# EAGLE design receiver_rev_a (EAGLE 7.3.0)
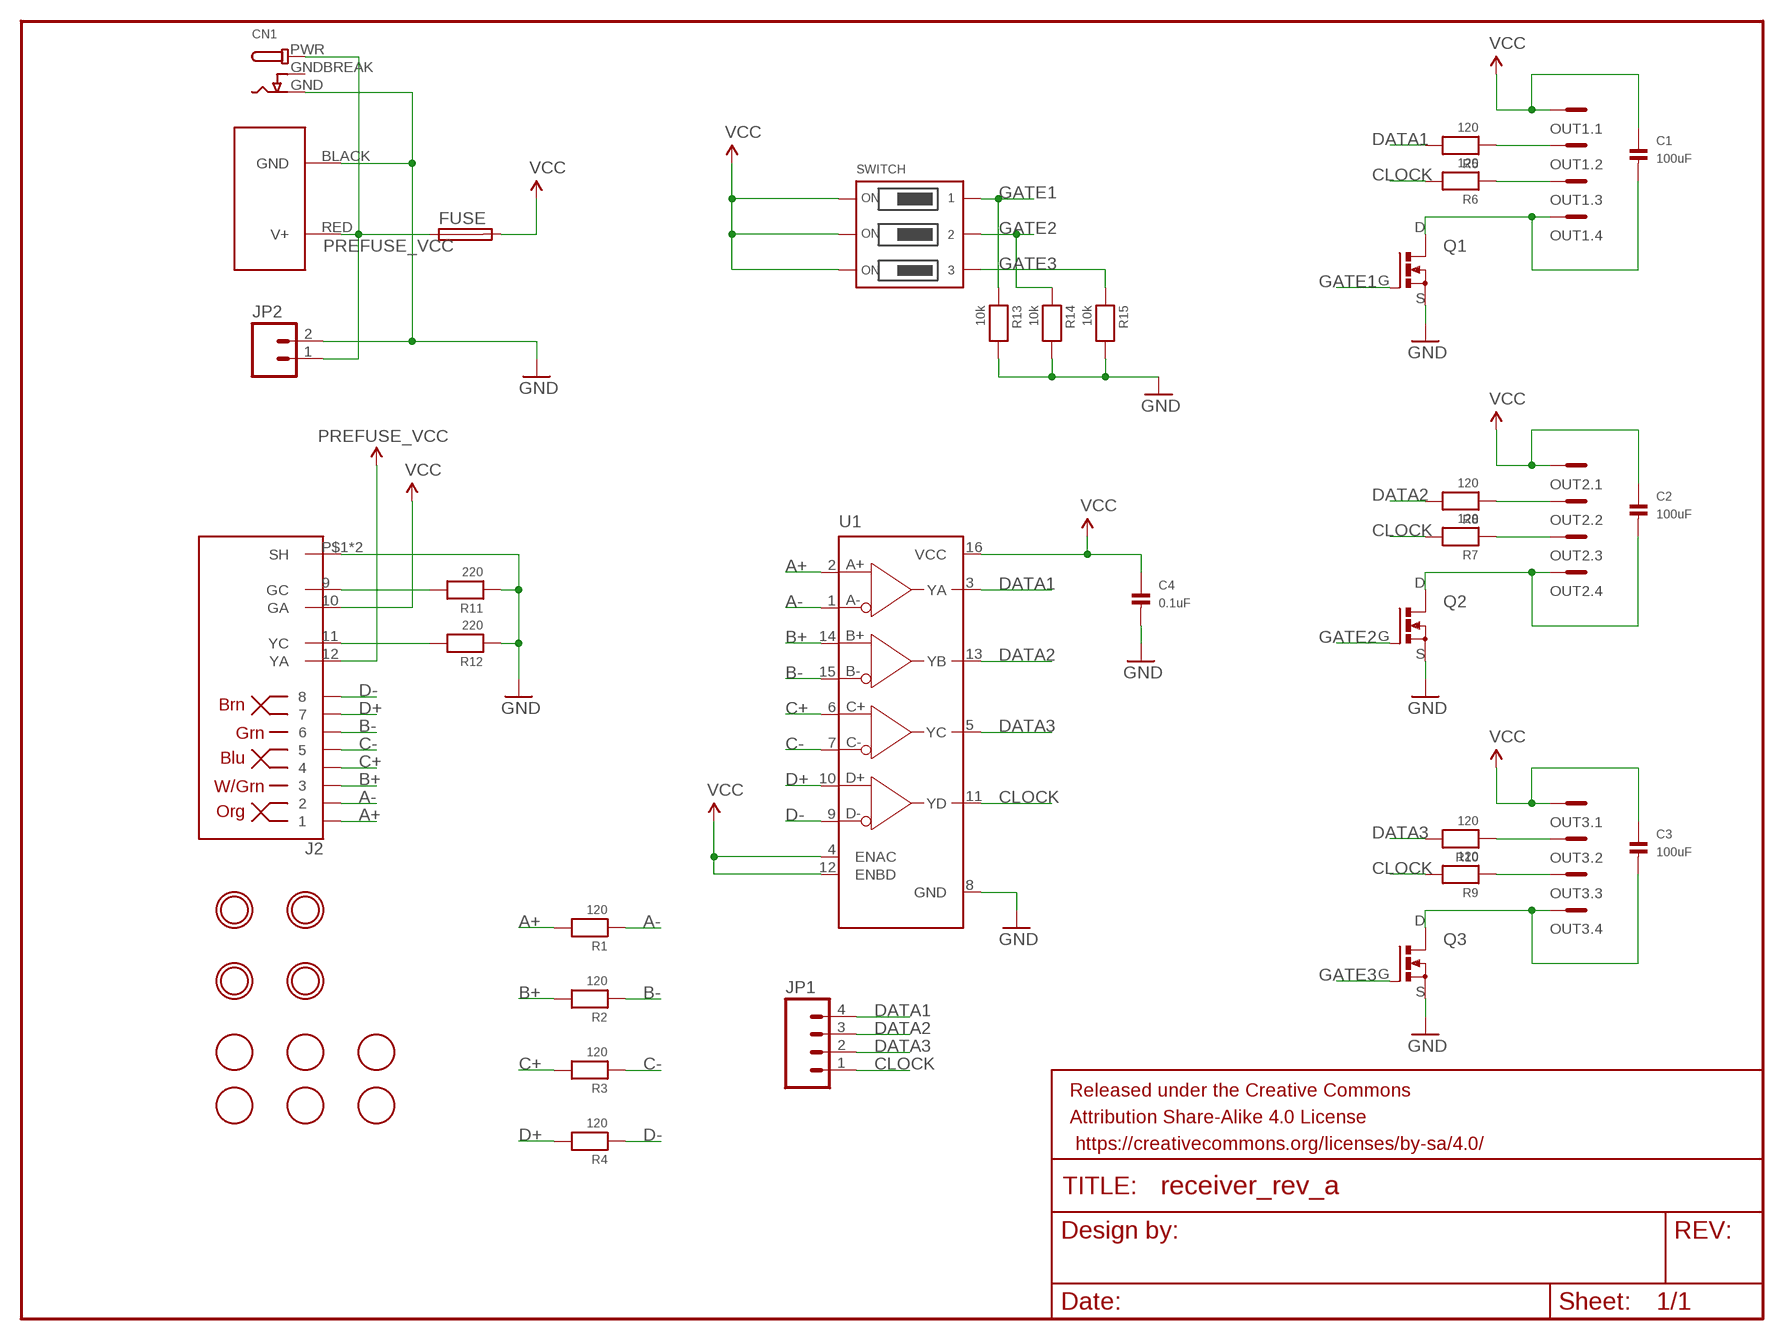
[diagram p0: schematic, sheet 1]

## Parts
C1  100uF  CAP_CERAMIC1206  [1206]
C2  100uF  CAP_CERAMIC1206  [1206]
C3  100uF  CAP_CERAMIC1206  [1206]
C4  0.1uF  CAP_CERAMIC0603MINI  [0603-MINI]
CN1  DCBARRELPTH  [DCJACK_2MM_PTH]
FID1  FIDUCIAL  [FIDUCIAL_1MM]
FID2  FIDUCIAL  [FIDUCIAL_1MM]
FID3  FIDUCIAL  [FIDUCIAL_1MM]
FID4  FIDUCIAL  [FIDUCIAL_1MM]
FID5  FIDUCIAL  [FIDUCIAL_1MM]
FID6  FIDUCIAL  [FIDUCIAL_1MM]
FRAME1  FRAME-LETTERNO_PACKAGE  [DUMMY]
FUSE  MINI-FUSE-HOLDER3557  [FUSE-HOLDER-3557]
J1  POWERPOLE_POWER45A_HORIZONTAL_DRILL  [POWERPOLE_PAIR_45A_HORIZ_HOLE]
J2  RJHSE-5381  [RJHSE-538X]
JP1  M04PTH  [1X04]
JP2  M02PTH4  [1X02_XTRA_BIG]
OUT1  MC4  [MC4]
OUT2  MC4  [MC4]
OUT3  MC4  [MC4]
Q1  DMN1019USN  [SC59]
Q2  DMN1019USN  [SC59]
Q3  DMN1019USN  [SC59]
R1  120  RESISTOR0603MINI  [0603-MINI]
R2  120  RESISTOR0603MINI  [0603-MINI]
R3  120  RESISTOR0603MINI  [0603-MINI]
R4  120  RESISTOR0603MINI  [0603-MINI]
R5  120  RESISTOR0603MINI  [0603-MINI]
R6  120  RESISTOR0603MINI  [0603-MINI]
R7  120  RESISTOR0603MINI  [0603-MINI]
R8  120  RESISTOR0603MINI  [0603-MINI]
R9  120  RESISTOR0603MINI  [0603-MINI]
R10  120  RESISTOR0603MINI  [0603-MINI]
R11  220  RESISTOR0603MINI  [0603-MINI]
R12  220  RESISTOR0603MINI  [0603-MINI]
R13  10k  RESISTOR0603MINI  [0603-MINI]
R14  10k  RESISTOR0603MINI  [0603-MINI]
R15  10k  RESISTOR0603MINI  [0603-MINI]
SWITCH  DIP-SWITCH-3PIN194  [194-DIP-SWITCH]
U1  MAX3093/94UE  [TSSOP16]
U$3  MOUNTINGHOLE2.5  [MOUNTINGHOLE_2.5_PLATED]
U$4  MOUNTINGHOLE2.5  [MOUNTINGHOLE_2.5_PLATED]
U$5  MOUNTINGHOLE2.5  [MOUNTINGHOLE_2.5_PLATED]
U$6  MOUNTINGHOLE2.5  [MOUNTINGHOLE_2.5_PLATED]

## Nets
A+: J2.1 R1.2 U1.2(A+)
A-: J2.2 R1.1 U1.1(A-)
B+: J2.3 R2.2 U1.14(B+)
B-: J2.6 R2.1 U1.15(B-)
C+: J2.4 R3.2 U1.6(C+)
C-: J2.5 R3.1 U1.7(C-)
CLOCK: JP1.1 R6.2 R7.2 R9.2 U1.11(YD)
D+: J2.7 R4.2 U1.10(D+)
D-: J2.8 R4.1 U1.9(D-)
DATA1: JP1.4 R5.2 U1.3(YA)
DATA2: JP1.3 R8.2 U1.13(YB)
DATA3: JP1.2 R10.2 U1.5(YC)
GATE1: Q1.G R13.1 SWITCH.1B
GATE2: Q2.G R14.1 SWITCH.2B
GATE3: Q3.G R15.1 SWITCH.3B
GND: C4.2 CN1.GND J1.BLACK(GND) J2.P$1(SH) J2.P$2(SH) JP2.2 Q1.S Q2.S Q3.S R11.1 R12.1 R13.2 R14.2 R15.2 U1.8(GND)
N$1: OUT1.2 R5.1
N$2: OUT1.3 R6.1
N$3: C1.2 OUT1.4 Q1.D
N$4: OUT2.2 R8.1
N$5: OUT2.3 R7.1
N$6: C2.2 OUT2.4 Q2.D
N$7: OUT3.2 R10.1
N$8: OUT3.3 R9.1
N$9: C3.2 OUT3.4 Q3.D
N$10: J2.9(GC) R11.2
N$11: J2.11(YC) R12.2
PREFUSE_VCC: CN1.PWR FUSE.A1 FUSE.A2 J1.RED(V+) J2.12(YA) JP2.1 ; supply symbol labelled VCC
VCC: C1.1 C2.1 C3.1 C4.1 FUSE.B1 FUSE.B2 J2.10(GA) OUT1.1 OUT2.1 OUT3.1 SWITCH.1A SWITCH.2A SWITCH.3A U1.4(ENAC) U1.12(ENBD) U1.16(VCC)

## Power pins joined to a net without a drawn wire
GNDBREAK: CN1.GNDBREAK

## Library data of the parts
C1-C4 = microbuilder:CAP_CERAMIC: Ceramic Capacitors 0402 - 0402 Surface Mount Capacitors 16pF 50V 5% [Digikey: 445-4899-2-ND] 18pF 50V 5% [Digikey: 490-1281-2-ND] 22pF 50V 5% [Digikey: 490-1283-2-ND] 68pF 50V 5% [Digikey: 490-1289-2-ND] 0.1uF 10V 10% [Digikey: 490-1318-2-ND] 1.0uF 6.3V 10% [Digikey: 490-1320-2-ND] 0603 - 0603 Surface Mount Capacitors 16 pF 50V 5% [Digikey: 445-5051-2-ND] 22 pF 50V [Digikey: PCC220ACVTR-ND] 33 pF 50V 5% [Digikey: 490-1415-1-ND] 56pF 50V 5% [Digikey: 490-1421-1-ND] 220pF 50V 5% [Digikey: 445-1285-1-ND] 680 pF 50V 2200 pF 50V 5% C0G [Digikey: 445-1297-1-ND] 5600 pF 100V 5% X7R [Digikey: 478-3711-1-ND] 0.1 µF 25V 10% [Digikey: PCC2277TR-ND] 0.22 µF 16V 10% X7R [Digikey: 445-1318-1-ND] 1.0 µF 25V 10% [Digikey: 445-5146-2-ND] 0603 - RF Specific 3pF 250V +/-0.1pF RF [Digikey: 712-1347-1-ND] 18 pF 250V 5% [Digikey: 478-3505-1-ND or 712-1322-1-ND] 56 pF 250V 5% C0G RF [Digikey: 490-4867-1-ND] 68 pF 250V RF [Digikey: 490-4868-1-ND] 0805 - 0805 Surface Mount Capacitors 220 pF 250V 2% RF Ceramic Capacitor [Digikey: 712-1398-1-ND] 1000 pF 50V 2% NP0 Ceramic Capacitor [Digikey: 478-3760-1-ND] 0.1 µF 25V 10% Ceramic Capacitor [Digikey: PCC1828TR-ND] 1.0 µF 16V 10% Ceramic Capacitor[Digikey: 490-1691-2-ND] 10.0 µF 10V 10% Ceramic Capacitor[Digikey: 709-1228-1-ND] 10.0 uF 16V 10% Ceramic Capacitor [Digikey: 478-5165-2-ND] 47 uF 6.3V 20% Ceramic Capacitor [Digikey: 587-1779-1-ND or 399-5506-1-ND] 1206 - 1206 Surface Mount Capacitors 47uF 10V 20% Ceramic Capacitor [Digikey: 490-5528-1-ND or 399-5508-1-ND or 445-6010-1-ND] 100uF 6.3V -20%, +80% Y5V Ceramic Capacitor (Digikey: 490-4512-1-ND, Mouser: 81-GRM31CF50J107ZE1L)
CN1 = microbuilder:DCBARREL: DC Barrel Jack DCJACK_1.3MM_PTH - Through Hole 1.3mm Jack (4UConnector: 05536) DCJACK_2MM_PTH - Through Hole 2.0/2.1 Jack (4UConnector: 05537) DCJACK_2MM_SMT - SMT 2.0/2.1mm Jack(4UConnector: 03267)
FID1-FID6 = adafruit:FIDUCIAL: For use by pick and place machines to calibrate the vision/machine, 1mm By microbuilder.eu
FRAME1 = SparkFun-Aesthetics:FRAME-LETTER: Schematic Frame Standard 8.5x11 US Letter frame; DESIGNER: Nobody; VERSION: v01
FUSE = Custom:MINI-FUSE-HOLDER
J1 = powerpoles:POWERPOLE_POWER: Anderson Powerpole Power Connector using ameteur radio standard layout
J2 = Custom:RJHSE-5381
JP1 = SparkFun-Connectors:M04: Header 4 Standard 4-pin 0.1" header. Use with straight break away headers (SKU : PRT-00116), right angle break away headers (PRT-00553), swiss pins (PRT-00743), machine pins (PRT-00117), and female headers (PRT-00115). Molex polarized connector foot print use with SKU : PRT-08231 with associated crimp pins and housings. 1MM SMD Version SKU: PRT-10208
JP2 = SparkFun-Connectors:M02: Standard 2-pin 0.1" header. Use with - straight break away headers ( PRT-00116) - right angle break away headers (PRT-00553) - swiss pins (PRT-00743) - machine pins (PRT-00117) - female headers (PRT-00115) Molex polarized connector foot print use with: PRT-08233 with associated crimp pins and housings. 2.54_SCREWTERM for use with PRT-10571. 3.5mm Screw Terminal footprints for PRT-08084 5mm Screw Terminal footprints for use with PRT-08432
OUT1-OUT3 = con-phoenix-381_l:MC4: Mini-Combicon 3.81mm horizontal 4-polig (ohne Gegenstecker)
Q1-Q3 = Custom:DMN1019USN
R1-R15 = microbuilder:RESISTOR: Resistors 0402 - 0402 Surface Mount Package 22 Ohm 1% 1/16W [Digikey: 311-22.0LRTR-ND] 33 Ohm 5% 1/16W 1.0K 5% 1/16W 1.5K 5% 1/16W 2.0K 1% 1/16W 10.0K 1% 1/16W [Digikey: 311-10.0KLRTR-ND] 10.0K 5% 1/16W [Digikey: RMCF0402JT10K0TR-ND] 12.1K 1% 1/16W [Digikey: 311-22.0LRTR-ND] 100.0K 5% 1/16W 0603 - 0603 Surface Mount Package 0 Ohm 1/10 Watt 1% Resistor 15 Ohm 1/10 Watt 1% Resistor 33 Ohm 1/10 Watt 1% Resistor 49.9 Ohm 1/10 Watt 1% Resistor 100 Ohm 1/10 Watt 1% Resistor 150 Ohm 1/10 Watt 1% Resistor 240 Ohm 1/10 Watt 1% Resistor 390 Ohm 1/10 Watt 1% Resistor 560 Ohm 1/10 Watt 1% Resistor 680 Ohm 1/10 Watt 1% Resistor 750 Ohm 1/10 Watt 1% Resistor 1.0K Ohm 1/10 Watt 1% Resistor 1.5K Ohm 1/10 Watt 1% Resistor 2.0K Ohm 1/10 Watt 1% Resistor 2.2K Ohm 1/10 Watt 1% Resistor 3.3K Ohm 1/10 Watt 1% Resistor 4.7K Ohm 1/10 Watt 1% Resistor 10.0K Ohm 1/10 Watt 1% Resistor 12.0K Ohm 1/10 Watt 1% Resistor 12.1K Ohm 1/10 Watt 1% Resistor 20.0K Ohm 1/10 Watt 1% Resistor 33.0K Ohm 1/10 Watt 1% Resistor 100.0K Ohm 1/10 Watt 1% Resistor 0805 - 0805 Surface Mount Package 0 Ohm 1/8 Watt 1% Resistor 33 Ohm 1/8 Watt 1% Resistor 100 Ohm 1/8 Watt 1% Resistor 150 Ohm 1/8 Watt 1% Resistor 200 Ohm 1/8 Watt 1% Resistor 240 Ohm 1/8 Watt 1% Resistor 330 Ohm 1/8 Watt 1% Resistor 390 Ohm 1/8 Watt 1% Resistor 470 Ohm 1/8 Watt 1% Resistor 1.0K Ohm 1/8 Watt 1% Resistor 1.5K Ohm 1/8 Watt 1% Resistor 2.0K Ohm 1/8 Watt 1% Resistor 4.7K Ohm 1/8 Watt 1% Resistor 5.1K Ohm 1/8 Watt 1% Resistor 5.6K Ohm 1/8 Watt 1% Resistor 10.0K Ohm 1/8 Watt 1% Resistor 22.0K Ohm 1/8 Watt 1% Resistor 33.0K Ohm 1/8 Watt 1% Resistor 100K Ohm 1/8 Watt 1% Resistor 1206 - 1206 Surface Mount Package 2012 - 2010 Surface Mount Package 0.11 Ohm 1/2 Watt 1% Resistor - Digikey: RHM.11UCT-ND
SWITCH = Custom:DIP-SWITCH-3PIN
U1 = maxim:MAX3093/94
U$3-U$6 = microbuilder:MOUNTINGHOLE: Mounting Hole For #2 screws (0.086"/2.18mm width, 0.094"/2.4mm hole) use 2.5mm

## Board
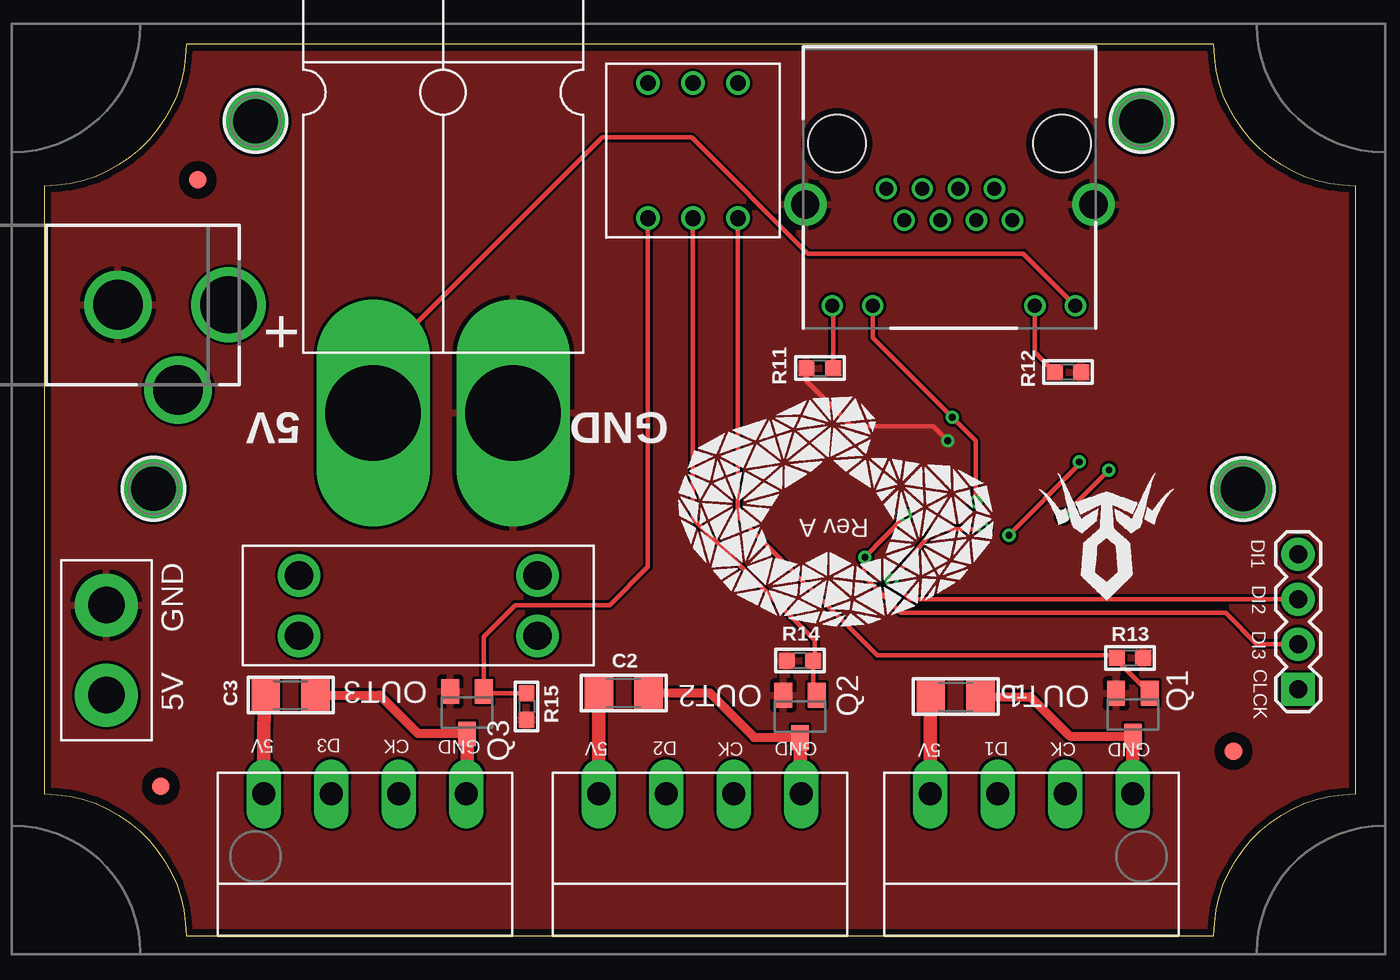
[diagram p1: board, top side]
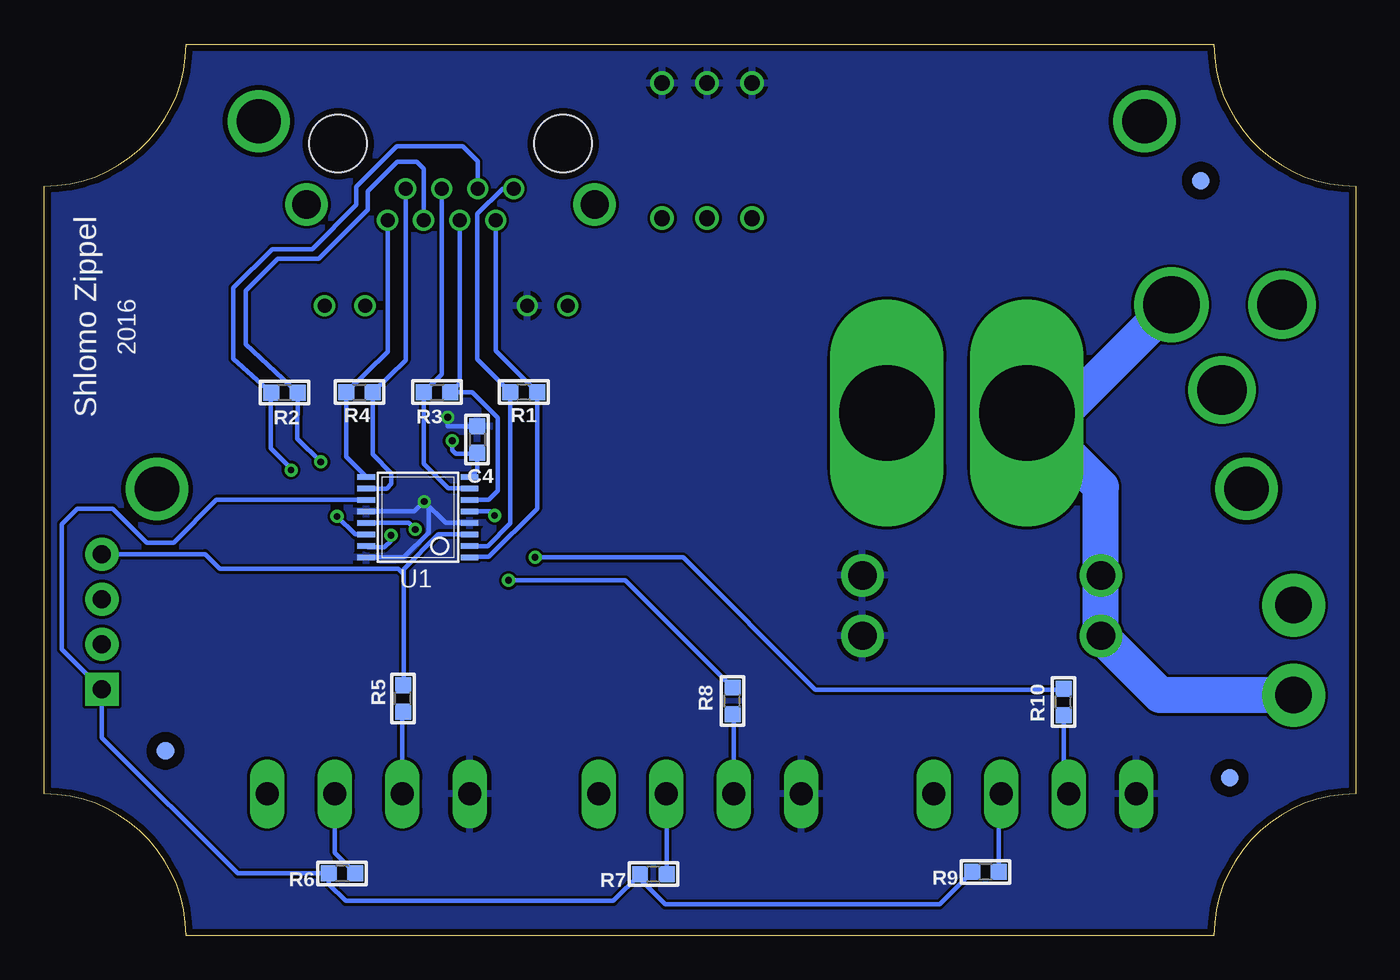
[diagram p2: board, bottom side, seen from below]

Size 74 x 50.3 mm. Coordinates in mm from the lower left corner, seen from the top.
Outline: 0,42.3 0,8 arc-90 8,0 66,0 arc-90 74,8 74,42.3 arc-90 66,50.3 8,50.3 arc-90 0,42.3
Copper layers (1*16): Top 0.0356mm / dielectric 1.5011mm / Bottom 0.0356mm
Design rules "PCBs_io": minimum track width 6mil, minimum drill 13mil, track to track 6mil, track to pad 6mil, pad to pad 6mil, via to via 6mil, smd to smd 6mil, copper to edge 15mil, drill to drill 6mil, minimum pad ring 7mil, minimum via ring 7mil, stop-mask expansion 3mil, vias tented up to drill 0mil, thermal gap 10mil

### Footprints (pad centres in the part's own frame; a part is rotated, then mirrored left to right if it is on the bottom)
1206 = smd 1.6 x 1.8: 1 -1.4,0; 2 1.4,0
0603-MINI = smd 0.9 x 0.9: 1 -0.75,0; 2 0.75,0
DCJACK_2MM_PTH = drill 2.8: GND 0,7.35; GNDBREAK 4.8,10.75 | drill 3.2: PWR 0,13.6
FIDUCIAL_1MM = smd 1 x 1: 1 0,0
FUSE-HOLDER-3557 = drill 1.6: A1 -6.731,1.702; A2 -6.731,-1.702; B1 6.731,1.702; B2 6.731,-1.702
POWERPOLE_PAIR_45A_HORIZ_HOLE = drill 5.4 long: BLACK 3.95,-3.4; RED -3.95,-3.4
RJHSE-538X = drill 0.8: 1 3.556,2.54; 2 2.54,4.32; 3 1.524,2.54; 4 0.508,4.32; 5 -0.508,2.54; 6 -1.524,4.32; 7 -2.54,2.54; 8 -3.556,4.32; 9 6.604,9.14; 10 4.318,9.14; 11 -4.826,9.14; 12 -7.112,9.14 | drill 1.6: P$1 -8.128,3.43; P$2 8.128,3.43 | hole 3.251: -6.35,0; 6.35,0
1X04 = drill 1.016 pad 1.88 square: 1 0,0 | drill 1.016 pad 1.88: 2 2.54,0; 3 5.08,0; 4 7.62,0
1X02_XTRA_BIG = drill 2.057 pad 3.556: 1 -2.54,0; 2 2.54,0
MC4 = drill 1.3 long: 1 -5.715,0; 2 -1.905,0; 3 1.905,0; 4 5.715,0
SC59 = smd 1 x 1.4: D 0,1.2; G -0.95,-1.2; S 0.95,-1.2
194-DIP-SWITCH = drill 0.889: 1A -2.54,-3.81; 1B -2.54,3.81; 2A 0,-3.81; 2B 0,3.81; 3A 2.54,-3.81; 3B 2.54,3.81
TSSOP16 = smd 0.305 x 0.991: 1 -2.275,-2.918; 2 -1.625,-2.918; 3 -0.975,-2.918; 4 -0.325,-2.918; 5 0.325,-2.918; 6 0.975,-2.918; 7 1.625,-2.918; 8 2.275,-2.918; 9 2.275,2.918; 10 1.625,2.918; 11 0.975,2.918; 12 0.325,2.918; 13 -0.325,2.918; 14 -0.975,2.918; 15 -1.625,2.918; 16 -2.275,2.918
MOUNTINGHOLE_2.5_PLATED = drill 2.5 pad 3.2: P$1 0,0

### Placement (x,y rotation side)
C1  51.42,13.48 0 top
C2  32.69,13.7 0 top
C3  13.9,13.58 0 top
C4  49.58,28 270 bottom
CN1  -3.2,35.6 270 top
FID1  6.58,8.43 0 top
FID2  67.1,10.42 0 top
FID3  8.66,42.64 0 top
FID4  7.12,8.9 0 bottom
FID5  8.74,42.61 0 bottom
FID6  67.16,10.43 0 bottom
FRAME1  -5,-4 0 top  (outside the outline)
FUSE  21.11,18.63 0 top
J1  22.5,32.9 0 top
J2  51.07,44.69 180 top
JP1  70.75,13.91 90 top
JP2  3.51,16.12 90 top
OUT1  55.7,8 0 top
OUT2  37,8 0 top
OUT3  18.1,8 0 top
Q1  61.43,12.47 180 top
Q2  42.64,12.36 180 top
Q3  23.85,12.58 180 top
R1  46.95,30.67 180 bottom
R2  60.44,30.65 180 bottom
R3  51.83,30.67 0 bottom
R4  56.22,30.67 0 bottom
R5  53.75,13.39 90 bottom
R6  57.2,3.52 180 bottom
R7  39.64,3.47 180 bottom
R8  35.16,13.25 90 bottom
R9  20.89,3.6 180 bottom
R10  16.48,13.18 90 bottom
R11  43.76,32.03 0 top
R12  57.76,31.8 180 top
R13  61.27,15.68 0 top
R14  42.64,15.53 180 top
R15  27.21,12.94 270 top
SWITCH  36.6,44.3 180 top
U1  52.91,23.62 90 bottom
U$2  [AK-B-FT21]  36.91,25.21 0 top
U$3  6.16,25.22 0 top
U$4  11.92,45.96 0 top
U$5  67.64,25.21 0 top
U$6  61.9,45.96 0 top

### Tracks (layer width: path | path; a pad name or v marks a point on that pad's centre or on a via)
A+
  Bottom 0.254: J2.1 48.14,42.15 49.56,40.73 49.56,32.53 R1.2 47.7,23.26 48.98,21.98 49.99,21.98 U1.2
A-
  Bottom 0.254: J2.2 48.53,33.01 R1.1 46.2,24.1 48.92,21.38 49.96,21.38 U1.1
B+  (via drill 0.38)
  Top 0.254: v57.48,23.66 57.48,23.69 v60.08,26.28
  Bottom 0.254: J2.3 49.55,43.69 50.4,44.54 54.11,44.54 56.39,42.25 56.39,41.24 58.88,38.75 61.14,38.75 63.33,36.56 63.33,32.55 R2.2 61.22,30.44 61.22,27.5 60.08,26.35 v60.08,26.28 | U1.14 56.47,22.64 v57.48,23.66
B-  (via drill 0.38)
  Top 0.254: v58.4,26.73 58.4,26.61 v54.44,22.59
  Bottom 0.254: J2.6 52.59,43.28 52.99,43.68 54.08,43.68 55.76,42 55.76,40.96 58.52,38.19 60.84,38.19 62.64,36.39 62.64,33.37 R2.1 59.72,28.05 v58.4,26.73 | v54.44,22.59 54.44,22.29 54.82,21.91 55.75,21.91 U1.15
C+
  Bottom 0.254: J2.4 50.56,31.19 R3.2 49.86,30.67 48.42,29.22 48.42,25.11 48.92,24.6 49.99,24.6 U1.6
C-
  Bottom 0.254: J2.5 51.58,31.67 R3.1 52.58,26.63 51.21,25.26 50.02,25.26 U1.7
CLOCK
  Bottom 0.254: R9.2 23.48,1.77 38.97,1.77 40.38,3.18 R7.2 41.89,1.97 57,1.97 57.95,2.91 R6.2 59.09,3.52 63.1,3.52 70.75,11.17 JP1.1 73,16.16 73,23.23 72.14,24.09 70.13,24.09 68.23,22.19 66.7,22.19 64.3,24.59 U1.11
D+
  Bottom 0.254: J2.7 53.61,32.48 R4.2 55.47,27.16 54.41,26.1 54.41,25.49 54.69,25.21 55.8,25.21 U1.10
D-
  Bottom 0.254: J2.8 54.63,32.96 R4.1 56.97,27.03 U1.9
DATA1
  Bottom 0.254: U1.3 51.77,22.64 53.73,20.69 53.73,20.41 | 53.73,20.41 53.73,14.17 R5.2 | JP1.4 64.93,21.53 64.11,20.71 54.03,20.71 53.73,20.41
DATA2  (via drill 0.38)
  Top 0.254: v53.06,22.92 50.22,22.92 v47.81,20.05 48.87,18.99 JP1.3
  Bottom 0.254: U1.13 53.43,23.29 v53.06,22.92 | v47.81,20.05 41.21,20.05 R8.2
DATA3  (via drill 0.38)
  Top 0.254: v48.59,23.71 48.59,23.69 v46.31,21.35 46.26,21.3 46.26,20.28 48.31,18.23 66.65,18.23 68.43,16.45 JP1.2
  Bottom 0.254: U1.5 48.82,23.94 v48.59,23.71 | v46.31,21.35 37.95,21.35 30.48,13.88 16.53,13.88 R10.2
GATE1
  Top 0.254: SWITCH.1B 39.14,23.67 46.99,15.81 60.39,15.81 R13.1 60.52,15.53 Q1.G
GATE2
  Top 0.254: SWITCH.2B 36.6,23.56 43.49,16.68 43.49,15.62 R14.1 43.39,13.77 Q2.G
GATE3
  Top 0.254: 27.3,13.78 R15.1 24.9,13.69 Q3.G 24.79,13.79 24.79,16.88 26.57,18.66 31.91,18.66 34.06,20.81 SWITCH.3B
GND  (via drill 0.38)
  Top 0.254: R11.1 43.01,31.3 45.57,28.74 50.17,28.74 v50.98,27.93
  Bottom 0.254: U1.8 49.58,26.31 C4.2 49.64,27.19 50.78,27.19 50.98,27.39 v50.98,27.93
  pour Top: -1.77,51.4 75.64,51.4 75.64,-1 -1.8,-1 -1.8,51.45
N$1
  Bottom 0.254: OUT1.2 53.8,12.59 R5.1
N$2
  Bottom 0.254: 57.59,8.01 OUT1.3 57.61,4.68 R6.1
N$3
  Top 0.508: C1.2 55.65,13.48 57.87,11.27 Q1.D
  Top 0.762: Q1.D 61.43,8.04 OUT1.4
N$4
  Bottom 0.254: OUT2.2 35.09,12.44 R8.1
N$5
  Bottom 0.254: R7.1 38.88,7.98 OUT2.3
N$6
  Top 0.508: C2.2 37.55,13.7 40.06,11.19 42.62,11.19 Q2.D
  Top 0.762: Q2.D 42.64,8.07 OUT2.4
N$7
  Bottom 0.254: R10.1 16.48,8.29 OUT3.2
N$8
  Bottom 0.254: R9.1 20.14,7.87 OUT3.3
N$9
  Top 0.508: C3.2 18.92,13.58 21.09,11.42 23.82,11.42 Q3.D
  Top 0.762: Q3.D 23.85,8.04 OUT3.4
N$10
  Top 0.254: R11.2 44.51,35.51 J2.9
N$11
  Top 0.254: J2.11 55.9,32.91 R12.2
PREFUSE_VCC
  Top 0.254: J1.RED 18.55,32.12 31.47,45.05 36.53,45.05 43.08,38.49 55.24,38.49 J2.12
  Bottom 2.032: JP2.1 11.03,13.58 FUSE.A2 FUSE.A1 14.38,25.33 J1.RED 16.5,29.5 CN1.PWR
VCC  (via drill 0.38)
  Top 0.254: J2.10 46.75,33.73 v51.24,29.25 52.56,27.93 v52.56,24.5
  Top 0.762: OUT3.1 12.39,11.87 C3.1 | OUT2.1 31.28,11.75 C2.1 | OUT1.1 49.99,11.8 C1.1
  Bottom 0.254: U1.12 53.11,23.94 v52.56,24.5 | U1.16 53.71,21.34 52.3,22.75 52.3,24.25 v52.56,24.5 | v51.24,29.25 51.24,28.74 C4.1 | U1.4 51.35,23.29 v52.56,24.5
  pour Bottom: -1.65,51.45 75.64,51.45 75.64,-1.08 -1.72,-1.08 -1.72,51.45

### Text on the board
tPlace: 5V | GND | Rev A | DI1 | DI2 | GND | DI3 | CLCK | 5V | 5V | D3 | CK | GND | 5V | D2 | CK | GND | 5V | D1 | CK | GND
bPlace: Shlomo Zippel | 2016